# EAGLE design module_ESP07 (EAGLE 9.0.1)
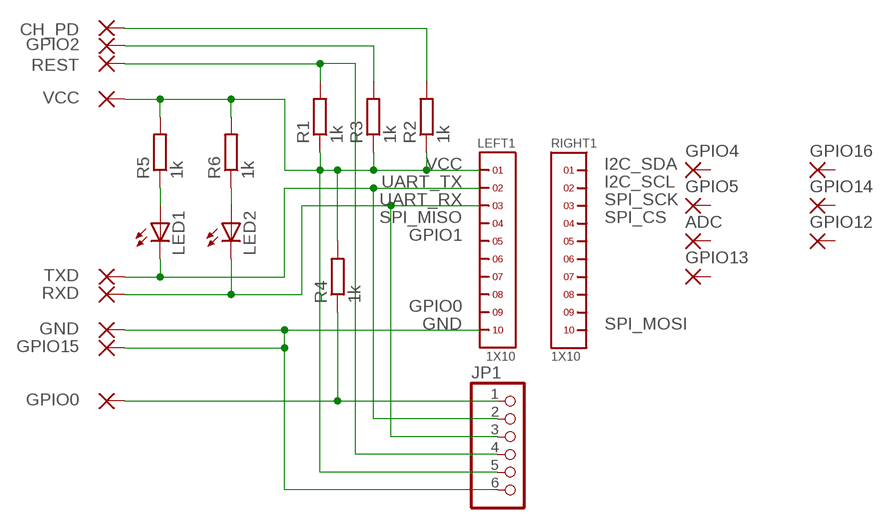
[diagram p0: schematic, sheet 1]

## Parts
ADC  WIREPADSMD1,27-254  [SMD1,27-2,54]
CH_PD  WIREPADSMD1,27-254  [SMD1,27-2,54]
GND  WIREPADSMD1,27-254  [SMD1,27-2,54]
GPIO0  WIREPADSMD1,27-254  [SMD1,27-2,54]
GPIO2  WIREPADSMD1,27-254  [SMD1,27-2,54]
GPIO4  WIREPADSMD1,27-254  [SMD1,27-2,54]
GPIO5  WIREPADSMD1,27-254  [SMD1,27-2,54]
GPIO12  WIREPADSMD1,27-254  [SMD1,27-2,54]
GPIO13  WIREPADSMD1,27-254  [SMD1,27-2,54]
GPIO14  WIREPADSMD1,27-254  [SMD1,27-2,54]
GPIO15  WIREPADSMD1,27-254  [SMD1,27-2,54]
GPIO16  WIREPADSMD1,27-254  [SMD1,27-2,54]
JP1  PINHD-1X6  [1X06]
LED1  LEDCHIPLED_0603  [CHIPLED_0603]
LED2  LEDCHIPLED_0603  [CHIPLED_0603]
LEFT1  1X10  [1X10]
R1  1k  R-EU_R0603  [R0603]
R2  1k  R-EU_R0603  [R0603]
R3  1k  R-EU_R0603  [R0603]
R4  1k  R-EU_R0603  [R0603]
R5  1k  R-EU_R0603  [R0603]
R6  1k  R-EU_R0603  [R0603]
REST  WIREPADSMD1,27-254  [SMD1,27-2,54]
RIGHT1  1X10  [1X10]
RXD  WIREPADSMD1,27-254  [SMD1,27-2,54]
TXD  WIREPADSMD1,27-254  [SMD1,27-2,54]
VCC  WIREPADSMD1,27-254  [SMD1,27-2,54]

## Nets
GND: GND.1(P) GPIO15.1(P) JP1.6 LEFT1.10
GPIO0: GPIO0.1(P) JP1.1 R4.1
N$1: GPIO2.1(P) R3.2
N$2: CH_PD.1(P) R2.2
N$3: LED2.A R6.1
N$4: LED1.A R5.1
RST: JP1.4 R1.2 REST.1(P)
UART_RX: JP1.3 LED2.C LEFT1.3 RXD.1(P)
UART_TX: JP1.2 LED1.C LEFT1.2 TXD.1(P)
VCC: JP1.5 LEFT1.1 R1.1 R2.1 R3.1 R4.2 R5.2 R6.2 VCC.1(P)
Unconnected: ADC.1(P) GPIO4.1(P) GPIO5.1(P) GPIO12.1(P) GPIO13.1(P) GPIO14.1(P) GPIO16.1(P) LEFT1.4 LEFT1.5 LEFT1.6 LEFT1.7 LEFT1.8 LEFT1.9 RIGHT1.1 RIGHT1.2 RIGHT1.3 RIGHT1.4 RIGHT1.5 RIGHT1.6 RIGHT1.7 RIGHT1.8 RIGHT1.9 RIGHT1.10

## Notes on the sheet
- VCC | I2C_SDA
- UART_TX | I2C_SCL
- UART_RX | SPI_SCK
- SPI_MISO | SPI_CS
- GPIO1
- GPIO0
- GND | SPI_MOSI

## Library data of the parts
ADC CH_PD GND GPIO0 GPIO2 GPIO4 GPIO5 GPIO12-GPIO16 REST RXD TXD VCC = wirepad:WIREPAD: Wire PAD connect wire on PCB
JP1 = pinhead:PINHD-1X6: PIN HEADER
LED1 LED2 = led:LED: LED OSRAM: - CHIPLED LG R971, LG N971, LY N971, LG Q971, LY Q971, LO R971, LY R971 LH N974, LH R974 LS Q976, LO Q976, LY Q976 LO Q996 - Hyper CHIPLED LW Q18S LB Q993, LB Q99A, LB R99A - SideLED LS A670, LO A670, LY A670, LG A670, LP A670 LB A673, LV A673, LT A673, LW A673 LH A674 LY A675 LS A676, LA A676, LO A676, LY A676, LW A676 LS A679, LY A679, LG A679 - Hyper Micro SIDELED® LS Y876, LA Y876, LO Y876, LY Y876 LT Y87S - SmartLED LW L88C, LW L88S LB L89C, LB L89S, LG L890 LS L89K, LO L89K, LY L89K LS L896, LA L896, LO L896, LY L896 - TOPLED LS T670, LO T670, LY T670, LG T670, LP T670 LSG T670, LSP T670, LSY T670, LOP T670, LYG T670 LG T671, LOG T671, LSG T671 LB T673, LV T673, LT T673, LW T673 LH T674 LS T676, LA T676, LO T676, LY T676, LB T676, LH T676, LSB T676, LW T676 LB T67C, LV T67C, LT T67C, LS T67K, LO T67K, LY T67K, LW E67C LS E67B, LA E67B, LO E67B, LY E67B, LB E67C, LV E67C, LT E67C LW T67C LS T679, LY T679, LG T679 LS T770, LO T770, LY T770, LG T770, LP T770 LB T773, LV T773, LT T773, LW T773 LH T774 LS E675, LA E675, LY E675, LS T675 LS T776, LA T776, LO T776, LY T776, LB T776 LHGB T686 LT T68C, LB T68C - Hyper Mini TOPLED® LB M676 - Mini TOPLED Santana® LG M470 LS M47K, LO M47K, LY M47K Source: http://www.osram.convergy.de LUXEON: - LUMILED® LXK2-PW12-R00, LXK2-PW12-S00, LXK2-PW14-U00, LXK2-PW14-V00 LXK2-PM12-R00, LXK2-PM12-S00, LXK2-PM14-U00 LXK2-PE12-Q00, LXK2-PE12-R00, LXK2-PE12-S00, LXK2-PE14-T00, LXK2-PE14-U00 LXK2-PB12-K00, LXK2-PB12-L00, LXK2-PB12-M00, LXK2-PB14-N00, LXK2-PB14-P00, LXK2-PB14-Q00 LXK2-PR12-L00, LXK2-PR12-M00, LXK2-PR14-Q00, LXK2-PR14-R00 LXK2-PD12-Q00, LXK2-PD12-R00, LXK2-PD12-S00 LXK2-PH12-R00, LXK2-PH12-S00 LXK2-PL12-P00, LXK2-PL12-Q00, LXK2-PL12-R00 Source: www.luxeon.com KINGBRIGHT: KA-3528ASYC Source: www.kingbright.com
LEFT1 RIGHT1 = headers(2mm):1X10
R1-R6 = rcl:R-EU_: RESISTOR, European symbol

## Board
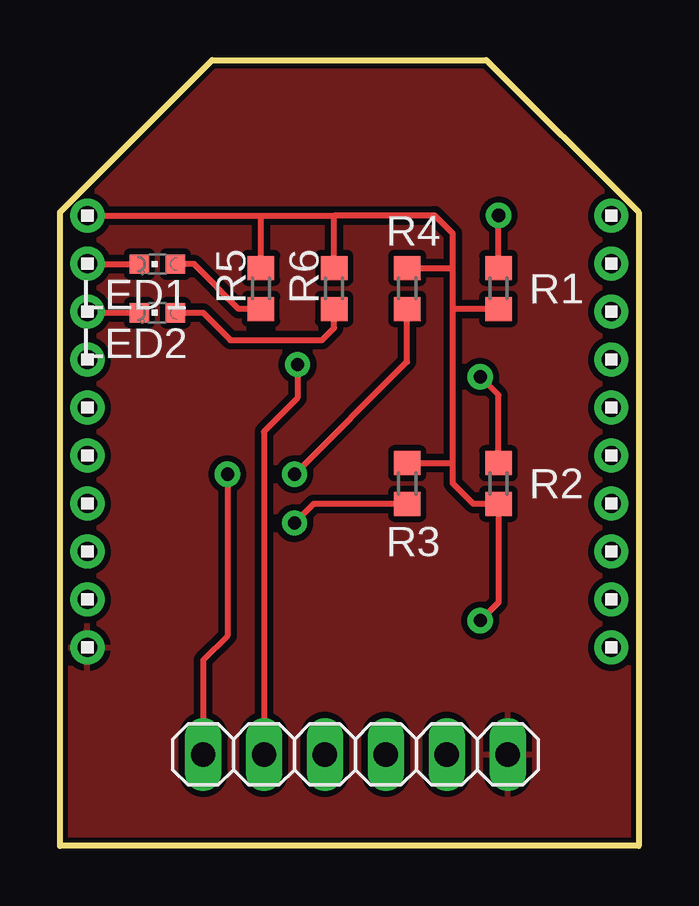
[diagram p1: board, top side]
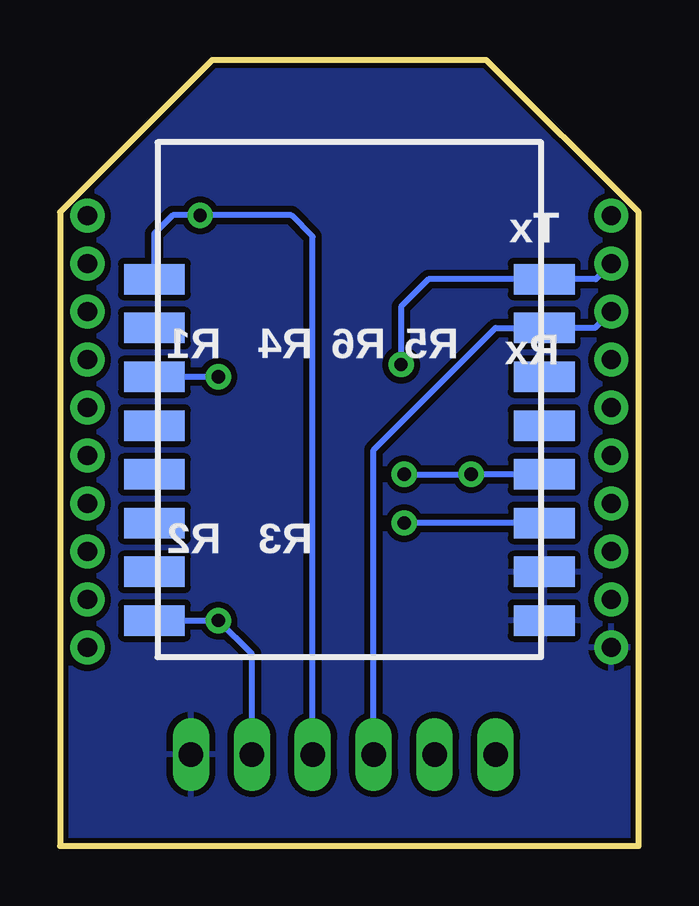
[diagram p2: board, bottom side, seen from below]

Size 24.13 x 32.77 mm. Coordinates in mm from the lower left corner, seen from the top.
Outline: 0,0 0,26.42 6.35,32.77 17.78,32.77 24.13,26.42 24.13,0 0,0
Copper layers (1*16): Top 0.035mm / dielectric 1.5mm / Bottom 0.035mm
Design rules "SparkFun-2-layer-STANDARD": minimum track width 10mil, minimum drill 20mil, track to track 10mil, track to pad 8mil, pad to pad 8mil, via to via 10mil, smd to smd 8mil, copper to edge 8mil, drill to drill 8mil, minimum pad ring 10mil, minimum via ring 10mil, stop-mask expansion 4mil, vias tented up to drill 25mil, thermal gap 10mil

### Footprints (pad centres in the part's own frame; a part is rotated, then mirrored left to right if it is on the bottom)
SMD1,27-2,54 = smd 1.27 x 2.54: 1 0,0
1X06 = drill 1.016 long: 1 -6.35,0; 2 -3.81,0; 3 -1.27,0; 4 1.27,0; 5 3.81,0; 6 6.35,0
CHIPLED_0603 = smd 0.8 x 0.8: A 0,-0.75; C 0,0.75
1X10 = drill 0.8 pad 1.422: 1 -9,0; 2 -7,0; 3 -5,0; 4 -3,0; 5 -1,0; 6 1,0; 7 3,0; 8 5,0; 9 7,0; 10 9,0
R0603 = smd 1 x 1.1: 1 -0.85,0; 2 0.85,0

### Placement (x,y rotation side)
ADC  20.19,21.59 90 bottom
CH_PD  20.19,19.56 270 bottom
GND  3.94,9.4 90 bottom
GPIO0  3.94,15.49 270 bottom
GPIO2  3.94,13.46 270 bottom
GPIO4  3.94,19.56 270 bottom
GPIO5  3.94,17.53 270 bottom
GPIO12  20.19,13.46 270 bottom
GPIO13  20.19,11.43 90 bottom
GPIO14  20.19,15.49 270 bottom
GPIO15  3.94,11.43 90 bottom
GPIO16  20.19,17.53 270 bottom
JP1  12.32,3.81 0 top
LED1  4.06,24.26 90 top
LED2  4.06,22.23 90 top
LEFT1  1.14,17.27 270 top
R1  18.29,23.24 90 top
R2  18.29,15.11 90 top
R3  14.48,15.11 270 top
R4  14.48,23.24 90 top
R5  8.38,23.24 90 top
R6  11.43,23.24 90 top
REST  20.19,23.62 270 bottom
RIGHT1  22.99,17.27 270 top
RXD  3.94,21.59 270 bottom
TXD  3.94,23.62 270 bottom
VCC  20.19,9.4 270 bottom

### Tracks (layer width: path | path; a pad name or v marks a point on that pad's centre or on a via)
GND
  pour Top: -0.25,-0.25 24.38,-0.25 24.38,26.54 17.91,33.02 6.22,33.02 -0.25,26.54
  pour Bottom: -0.51,-0.51 24.64,-0.51 24.64,26.67 18.03,33.27 6.1,33.27 -0.51,26.67
GPIO0  (via drill 0.55)
  Top 0.254: v6.99,15.49 6.99,8.76 5.97,7.75 JP1.1 | v9.78,15.49 14.48,20.19 R4.1
  Bottom 0.254: GPIO0.1 v6.99,15.49 v9.78,15.49
N$1  (via drill 0.55)
  Top 0.254: R3.2 10.58,14.26 v9.78,13.46
  Bottom 0.254: GPIO2.1 v9.78,13.46
N$2  (via drill 0.55)
  Top 0.254: R2.2 18.29,18.8 v17.53,19.56
  Bottom 0.254: CH_PD.1 v17.53,19.56
N$3
  Top 0.254: LED2.A 5.97,22.23 7.11,21.08 10.92,21.08 11.43,21.59 R6.1
N$4
  Top 0.254: R5.1 7.45,22.39 5.59,24.26 LED1.A
RST  (via drill 0.55)
  Top 0.254: R1.2 v18.29,26.29
  Bottom 0.254: REST.1 20.19,25.53 19.43,26.29 v18.29,26.29 14.48,26.29 13.59,25.4 JP1.4
UART_RX
  Top 0.254: LEFT1.3 1.19,22.23 LED2.C
  Bottom 0.254: LEFT1.3 1.82,21.59 RXD.1 5.97,21.59 11.05,16.51 JP1.3
UART_TX  (via drill 0.55)
  Top 0.254: LEFT1.2 1.16,24.26 LED1.C | v9.91,20.07 9.91,18.67 8.51,17.27 JP1.2
  Bottom 0.254: LEFT1.2 1.79,23.62 TXD.1 8.76,23.62 9.91,22.48 v9.91,20.07
VCC  (via drill 0.55)
  Top 0.254: LEFT1.1 8.38,26.27 | 8.38,26.27 11.43,26.27 | v17.53,9.4 18.29,10.16 R2.1 17.23,14.26 16.38,15.11 16.38,15.96 | R5.2 8.38,26.27 | R6.2 11.43,26.27 | 16.38,15.96 16.38,22.39 | 16.38,22.39 16.38,24.09 | 16.38,24.09 16.38,25.53 15.62,26.29 15.6,26.27 11.43,26.27 | R3.1 16.38,15.96 | R1.1 16.38,22.39 | R4.2 16.38,24.09
  Bottom 0.254: VCC.1 v17.53,9.4 16.13,8 JP1.5

### Text on the board
_bNames: Tx | Rx | R5 | R6 | R4 | R1 | R3 | R2
_tDocu: PWR: / LOG: | 3.3 V / 3.3 V | ESP-07 | GPIO0 | TXD | RXD | RST | VCC | GND
_bDocu: GPIO0 | TXD | RXD | RST | VCC | GND